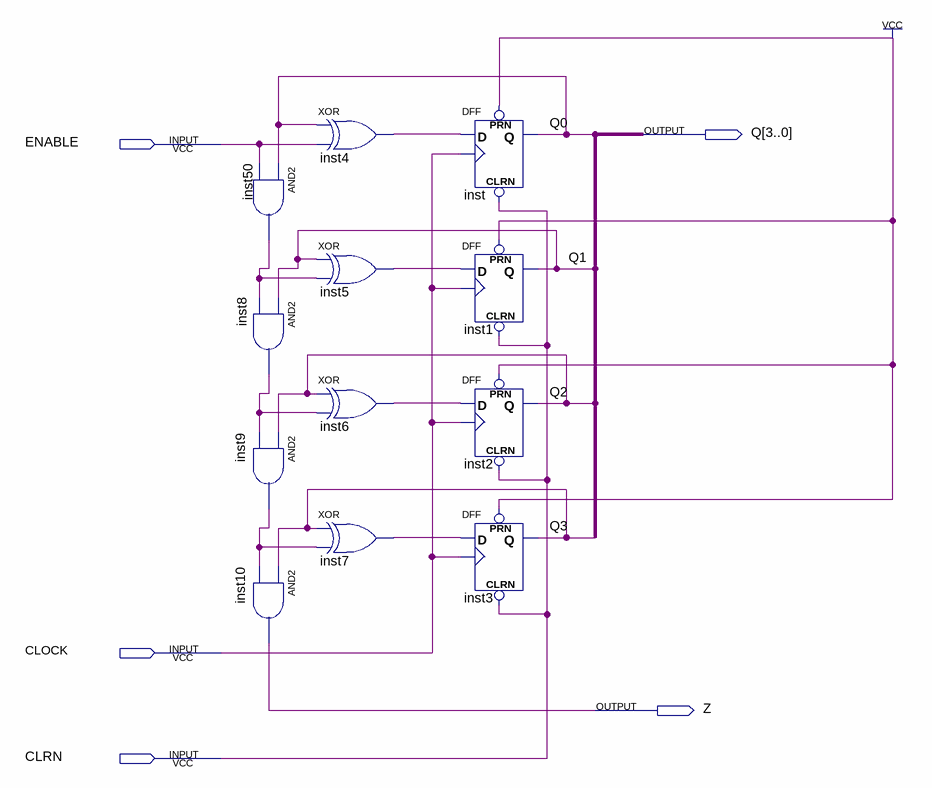
[diagram p0: schematic sheet]
// Quartus schematic lab10step2a.bdf as structural Verilog: 12 symbols, 5 pins
module lab10step2a (
  input  ENABLE,
  input  CLOCK,
  input  CLRN,
  output [3:0] Q,
  output Z
);

  wire inst4_out, inst5_out, inst6_out, inst7_out, inst8_out, inst9_out, inst50_out;

  and inst50 (inst50_out, Q[0], ENABLE);
  and inst8 (inst8_out, Q[1], inst50_out);
  and inst9 (inst9_out, Q[2], inst8_out);
  and inst10 (Z, Q[3], inst9_out);
  xor inst4 (inst4_out, Q[0], ENABLE);
  xor inst5 (inst5_out, Q[1], inst50_out);
  xor inst6 (inst6_out, Q[2], inst8_out);
  xor inst7 (inst7_out, Q[3], inst9_out);
  DFF inst (.CLRN(CLRN), .CLK(CLOCK), .D(inst4_out), .PRN(1'b1), .Q(Q[0]));
  DFF inst1 (.CLRN(CLRN), .CLK(CLOCK), .D(inst5_out), .PRN(1'b1), .Q(Q[1]));
  DFF inst2 (.CLRN(CLRN), .CLK(CLOCK), .D(inst6_out), .PRN(1'b1), .Q(Q[2]));
  DFF inst3 (.CLRN(CLRN), .CLK(CLOCK), .D(inst7_out), .PRN(1'b1), .Q(Q[3]));
endmodule
